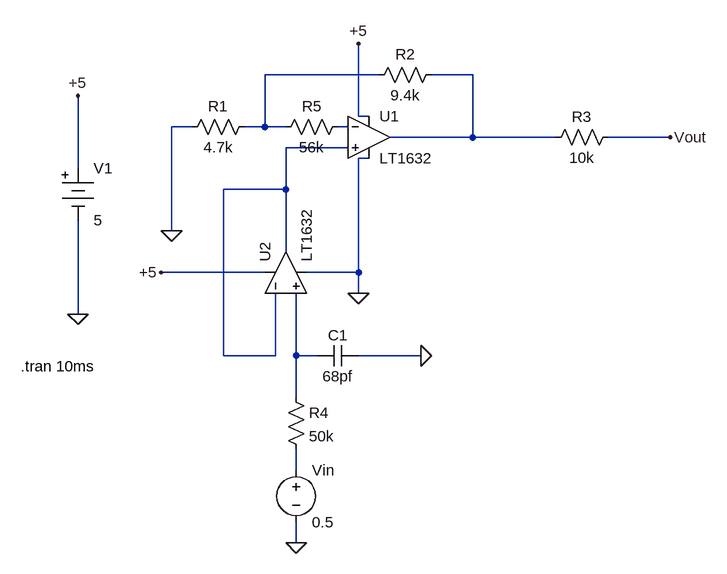
[diagram p0: schematic IoT-asemaprojekti_LTspice.asc]
IoT-asemaprojekti_LTspice.asc, the LTspice schematic file:
Version 4
SHEET 1 880 832
WIRE 320 32 144 32
WIRE 464 32 400 32
WIRE 288 96 288 -16
WIRE 304 96 288 96
WIRE 32 112 0 112
WIRE 144 112 144 32
WIRE 144 112 112 112
WIRE 176 112 144 112
WIRE 272 112 256 112
WIRE 464 128 464 32
WIRE 464 128 336 128
WIRE 592 128 464 128
WIRE 768 128 672 128
WIRE 272 144 176 144
WIRE 304 160 288 160
WIRE -144 176 -144 64
WIRE 176 208 176 144
WIRE 176 208 80 208
WIRE 0 272 0 112
WIRE 176 304 176 208
WIRE 144 336 -16 336
WIRE 288 336 288 160
WIRE 288 336 208 336
WIRE 288 368 288 336
WIRE -144 400 -144 256
WIRE 80 464 80 208
WIRE 160 464 160 368
WIRE 160 464 80 464
WIRE 192 464 192 368
WIRE 224 464 192 464
WIRE 384 464 288 464
WIRE 192 528 192 464
WIRE 192 640 192 608
WIRE 192 752 192 720
FLAG -144 64 +5
FLAG 288 368 0
FLAG 288 -16 +5
FLAG 0 272 0
FLAG -144 400 0
FLAG 768 128 Vout
FLAG 192 752 0
FLAG -16 336 +5
FLAG 384 464 0
SYMBOL res 128 96 R90
WINDOW 0 0 56 VBottom 2
WINDOW 3 32 56 VTop 2
SYMATTR InstName R1
SYMATTR Value 4.7k
SYMBOL res 416 16 R90
WINDOW 0 0 56 VBottom 2
WINDOW 3 32 56 VTop 2
SYMATTR InstName R2
SYMATTR Value 9.4k
SYMBOL Misc/battery -144 160 R0
SYMATTR InstName V1
SYMATTR Value 5
SYMBOL OpAmps/LT1632 304 64 R0
SYMATTR InstName U1
SYMBOL res 688 112 R90
WINDOW 0 0 56 VBottom 2
WINDOW 3 32 56 VTop 2
SYMATTR InstName R3
SYMATTR Value 10k
SYMBOL res 176 512 R0
SYMATTR InstName R4
SYMATTR Value 50k
SYMBOL voltage 192 624 R0
SYMATTR InstName Vin
SYMATTR Value 0.5
SYMATTR Value2 AC 1
SYMBOL OpAmps/LT1632 112 336 R270
SYMATTR InstName U2
SYMBOL cap 288 448 R90
WINDOW 0 0 32 VBottom 2
WINDOW 3 32 32 VTop 2
SYMATTR InstName C1
SYMATTR Value 68pf
SYMBOL res 272 96 R90
WINDOW 0 0 56 VBottom 2
WINDOW 3 32 56 VTop 2
SYMATTR InstName R5
SYMATTR Value 56k
TEXT -232 480 Left 2 !.tran 10ms

The netlist it stands for:
* IoT-asemaprojekti_LTspice.asc
R1 N001 0 4.7k
R2 N002 N001 9.4k
V1 +5 0 5
XU1 N004 N003 +5 0 N002 LT1632  ; pins In+ In- V+ V- OUT
R3 Vout N002 10k
R4 N005 N006 50k
Vin N006 0 0.5 AC 1
XU2 N005 N004 +5 0 N004 LT1632  ; pins In+ In- V+ V- OUT
C1 0 N005 68pf
R5 N003 N001 56k
.tran 10ms
.lib LTC.lib
.backanno
.end